# EAGLE design LEDMatrixMC (EAGLE 6.3)
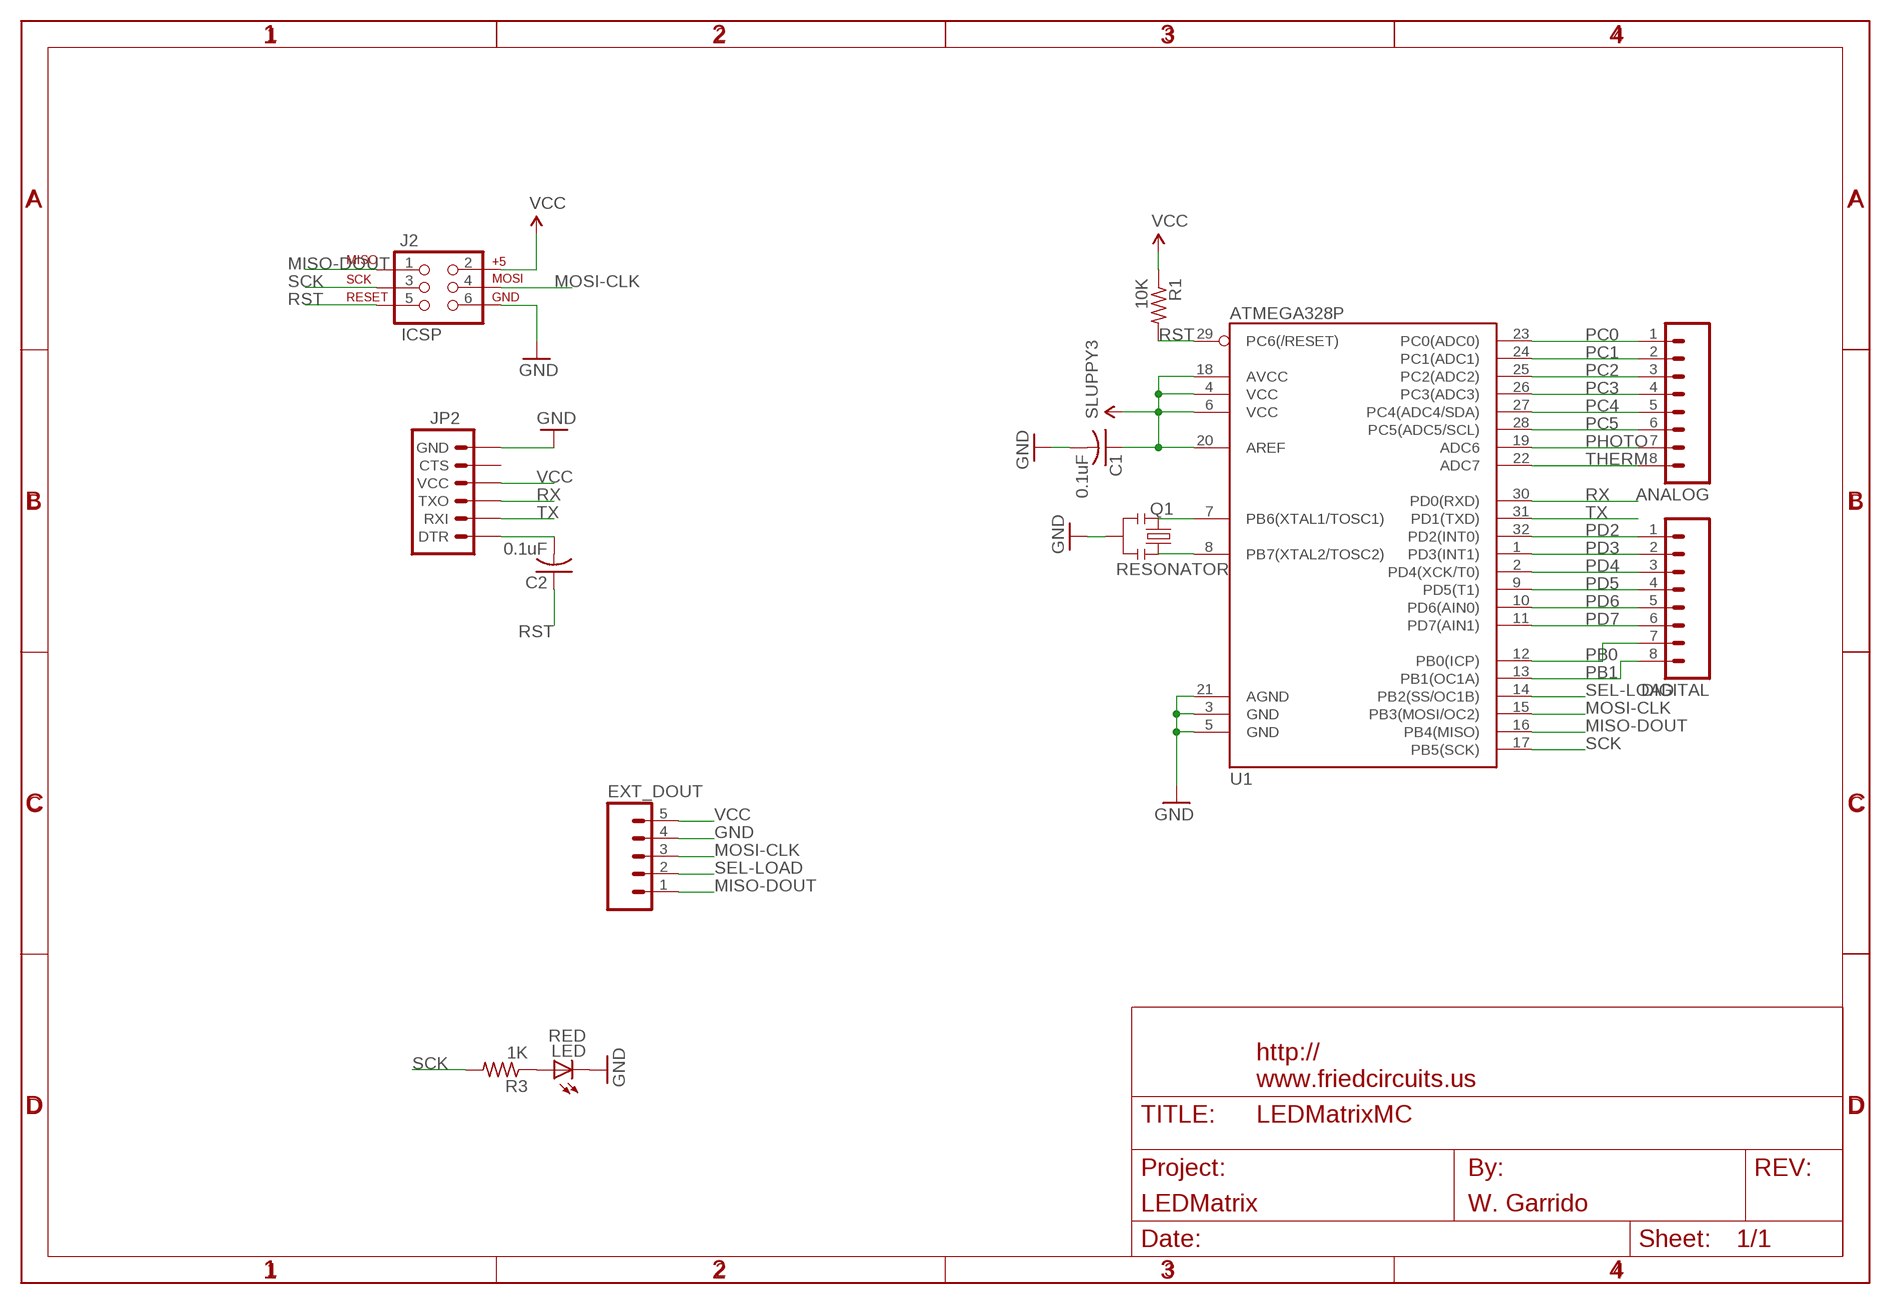
[diagram p0: schematic, sheet 1]

## Parts
ANALOG  M08LOCK  [1X08_LOCK]
C1  0.1uF  C-USC0805K  [C0805K]
C2  0.1uF  C-USC0805K  [C0805K]
DIGITAL  M08LOCK  [1X08_LOCK]
EXT_DOUT  M05LOCK_LONGPADS  [1X05_LOCK_LONGPADS]
J2  ICSP  AVR_SPI_PRG_62X3_LOCK  [2X3_LOCK]
JP2  ARDUINO_SERIAL_PROGRAMLOCK  [1X06_LOCK]
LED  RED  LEDCHIPLED_0805  [CHIPLED_0805]
Q1  RESONATOR  RESONATORSMD  [RESONATOR-SMD]
R1  10K  R-US_R0805  [R0805]
R3  1K  R-US_R0805  [R0805]
U1  ATMEGA328P  ATMEGA328_SMT  [TQFP32-08]
U$1  FRAME_DINA4_L  [FC_CREDIT]

## Nets
GND: C1.2 EXT_DOUT.4 J2.6 JP2.6(GND) LED.C Q1.2 U1.3(GND) U1.5(GND) U1.21(AGND)
MISO-DOUT: EXT_DOUT.1 J2.1 U1.16(PB4(MISO))
MOSI-CLK: EXT_DOUT.3 J2.4 U1.15(PB3(MOSI/OC2))
N$1: C2.2 JP2.1(DTR)
N$5: Q1.1 U1.8(PB7(XTAL2/TOSC2))
N$6: Q1.3 U1.7(PB6(XTAL1/TOSC1))
N$22: LED.A R3.1
PB0: DIGITAL.7 U1.12(PB0(ICP))
PB1: DIGITAL.8 U1.13(PB1(OC1A))
PC0: ANALOG.1 U1.23(PC0(ADC0))
PC1: ANALOG.2 U1.24(PC1(ADC1))
PC2: ANALOG.3 U1.25(PC2(ADC2))
PC3: ANALOG.4 U1.26(PC3(ADC3))
PC4: ANALOG.5 U1.27(PC4(ADC4/SDA))
PC5: ANALOG.6 U1.28(PC5(ADC5/SCL))
PD2: DIGITAL.1 U1.32(PD2(INT0))
PD3: DIGITAL.2 U1.1(PD3(INT1))
PD4: DIGITAL.3 U1.2(PD4(XCK/T0))
PD5: DIGITAL.4 U1.9(PD5(T1))
PD6: DIGITAL.5 U1.10(PD6(AIN0))
PD7: DIGITAL.6 U1.11(PD7(AIN1))
PHOTO: ANALOG.7 U1.19(ADC6)
RST: C2.1 J2.5 R1.2 U1.29(PC6(/RESET))
RX: JP2.3(TXO) U1.30(PD0(RXD))
SCK: J2.3 R3.2 U1.17(PB5(SCK))
SEL-LOAD: EXT_DOUT.2 U1.14(PB2(SS/OC1B))
THERM: ANALOG.8 U1.22(ADC7)
TX: JP2.2(RXI) U1.31(PD1(TXD))
VCC [power]: C1.1 EXT_DOUT.5 J2.2 JP2.4(VCC) R1.1 U1.4(VCC) U1.6(VCC) U1.18(AVCC) U1.20(AREF) ; supply symbol labelled SLUPPY3
Unconnected: JP2.5(CTS)

## Library data of the parts
ANALOG DIGITAL = SparkFun-Connectors:M08: Header 8 Standard 8-pin 0.1" header. Use with straight break away headers (SKU : PRT-00116), right angle break away headers (PRT-00553), swiss pins (PRT-00743), machine pins (PRT-00117), and female headers (PRT-00115).
C1 C2 = adafruit:C-US: CAPACITOR, American symbol
EXT_DOUT = SparkFun-Connectors:M05: Header 5 Standard 5-pin 0.1" header. Use with straight break away headers (SKU : PRT-00116), right angle break away headers (PRT-00553), swiss pins (PRT-00743), machine pins (PRT-00117), and female headers (PRT-00115). Molex polarized connector foot print use with SKU : PRT-08230 with associated crimp pins and housings.
J2 = SparkFun-Connectors:AVR_SPI_PRG_6: AVR ISP 6 Pin This is the reduced ISP connector for AVR programming. Common on Arduino. This footprint will take up less PCB space and can be used with a 10-pin to 6-pin adapter such as SKU: BOB-08508
JP2 = SparkFun-Connectors:ARDUINO_SERIAL_PROGRAM: FTDI connector footprints
LED = adafruit:LED: LED OSRAM: - CHIPLED LG R971, LG N971, LY N971, LG Q971, LY Q971, LO R971, LY R971 LH N974, LH R974 LS Q976, LO Q976, LY Q976 LO Q996 - Hyper CHIPLED LW Q18S LB Q993, LB Q99A, LB R99A - SideLED LS A670, LO A670, LY A670, LG A670, LP A670 LB A673, LV A673, LT A673, LW A673 LH A674 LY A675 LS A676, LA A676, LO A676, LY A676, LW A676 LS A679, LY A679, LG A679 - Hyper Micro SIDELED® LS Y876, LA Y876, LO Y876, LY Y876 LT Y87S - SmartLED LW L88C, LW L88S LB L89C, LB L89S, LG L890 LS L89K, LO L89K, LY L89K LS L896, LA L896, LO L896, LY L896 - TOPLED LS T670, LO T670, LY T670, LG T670, LP T670 LSG T670, LSP T670, LSY T670, LOP T670, LYG T670 LG T671, LOG T671, LSG T671 LB T673, LV T673, LT T673, LW T673 LH T674 LS T676, LA T676, LO T676, LY T676, LB T676, LH T676, LSB T676, LW T676 LB T67C, LV T67C, LT T67C, LS T67K, LO T67K, LY T67K, LW E67C LS E67B, LA E67B, LO E67B, LY E67B, LB E67C, LV E67C, LT E67C LW T67C LS T679, LY T679, LG T679 LS T770, LO T770, LY T770, LG T770, LP T770 LB T773, LV T773, LT T773, LW T773 LH T774 LS E675, LA E675, LY E675, LS T675 LS T776, LA T776, LO T776, LY T776, LB T776 LHGB T686 LT T68C, LB T68C - Hyper Mini TOPLED® LB M676 - Mini TOPLED Santana® LG M470 LS M47K, LO M47K, LY M47K Source: http://www.osram.convergy.de/
Q1 = SparkFun:RESONATOR: Resonator Small SMD resonator. This is the itty bitty 10/20MHz resonators with built in caps. CSTCE10M0G55 and CSTCE20M0V53. Footprint has been reviewed closely but hasn't been tested yet.
R1 R3 = adafruit:R-US_: RESISTOR, American symbol
U1 = SparkFun-DigitalIC:ATMEGA328_SMT: 32-Pin Atmega328 part Commonly used on Arduino compatible boards Available in QFP and QFN packages TQFP is IC-09069 QFN is non-stock; PROD_ID: IC-09069
U$1 = FriedCircuits:FRAME_DINA4_L: A4 FC frame Standard FriedCircuits schematic frame. Automagically adds the standard texts to the PCB Use the atrribute in the schematic editor to change the fields.; AUTHOR: W. Garrido; FF1: fulfillment by; FF2: FriedCircuits; FF3: www.friedcircuits.us; PROJECT: LEDMatrix; URL1: http://; URL2: www.friedcircuits.us

## Net classes
0 default: width 0.203 mm, drill 0.203 mm
1 power: width 0.254 mm, drill 0.203 mm
3 3.3V: width 0.254 mm, drill 0.203 mm

## Board
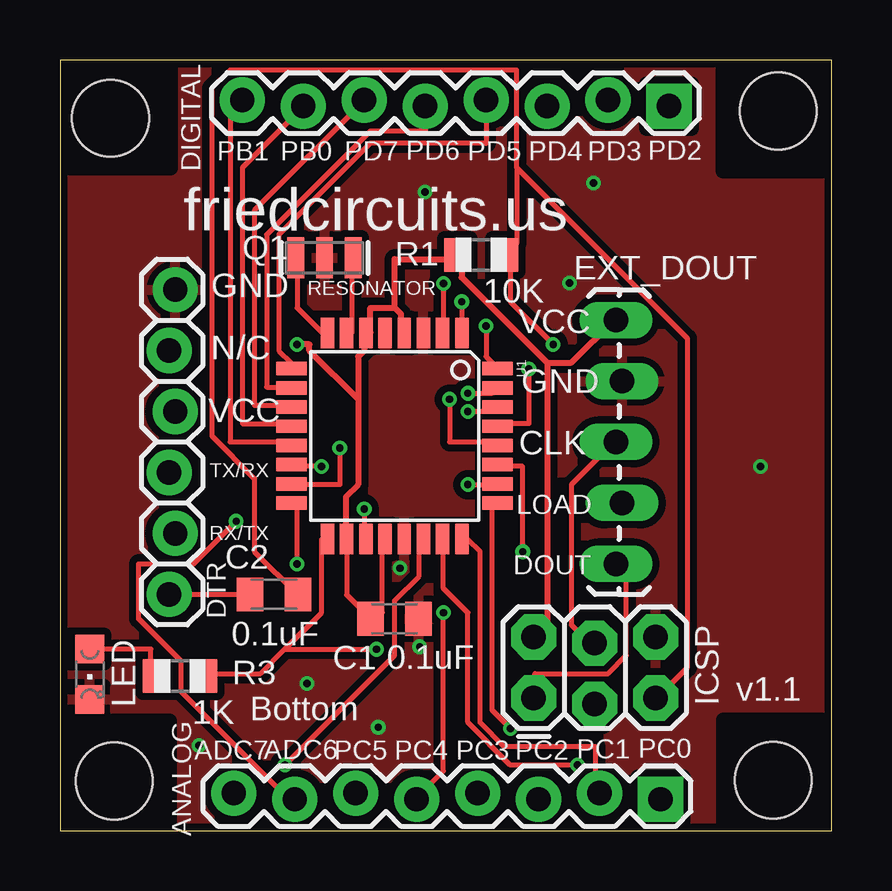
[diagram p1: board, top side]
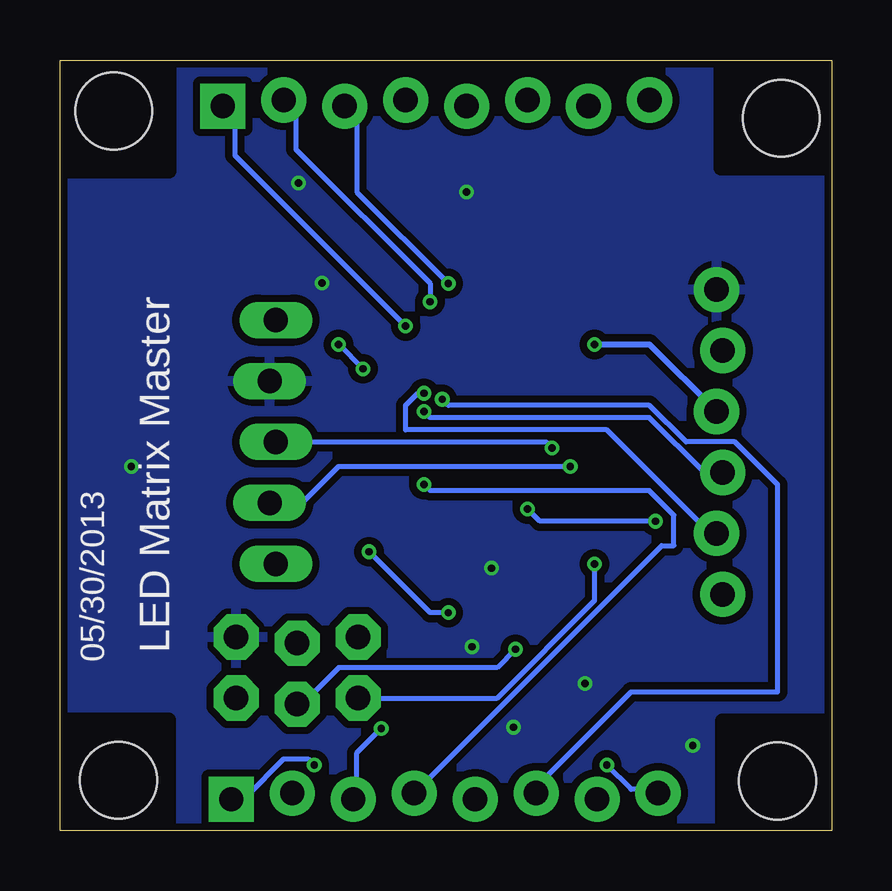
[diagram p2: board, bottom side, seen from below]

Size 32.16 x 32.12 mm. Coordinates in mm from the lower left corner, seen from the top.
Outline: 0,0 32.16,0 32.16,32.12 0,32.12 0,0
Copper layers (1*16): Top 0.035mm / dielectric 1.5mm / Bottom 0.035mm
Design rules "Fusion_eagle_rule_v1.1": minimum track width 6mil, minimum drill 12mil, track to track 6mil, track to pad 6mil, pad to pad 6mil, via to via 6mil, smd to smd 0mil, copper to edge 10mil, drill to drill 10mil, minimum pad ring 10mil, minimum via ring 6mil, stop-mask expansion 2mil, vias tented up to drill 100mil, thermal gap 10mil
Holes 3.2 mm at 29.92,30 2.26,2.08 29.72,2.11 2.11,29.69
tRestrict: area 27.6,27.5 to 32,32; area 0.2,0.1 to 4.6,4.6; area 27.6,0.2 to 32,4.6; area 0.2,27.6 to 4.6,32
bRestrict: area 27.6,27.5 to 32,32; area 0.2,0.1 to 4.6,4.6; area 27.6,0.2 to 32,4.6; area 0.2,27.6 to 4.6,32

### Footprints (pad centres in the part's own frame; a part is rotated, then mirrored left to right if it is on the bottom)
1X08_LOCK = drill 1.016 pad 1.88 square: 1 0,0.127 | drill 1.016 pad 1.88: 2 2.54,-0.127; 3 5.08,0.127; 4 7.62,-0.127; 5 10.16,0.127; 6 12.7,-0.127; 7 15.24,0.127; 8 17.78,-0.127
C0805K = smd 1.1 x 1.4: 1 -1,0; 2 1,0
1X05_LOCK_LONGPADS = drill 1.016 long: 1 0,0; 2 2.54,-0.254; 3 5.08,0; 4 7.62,-0.254; 5 10.16,0
2X3_LOCK = drill 1.016 pad 1.88 octagon: 1 0,0; 2 0,2.54; 3 2.54,-0.254; 4 2.54,2.286; 5 5.08,0; 6 5.08,2.54
1X06_LOCK = drill 1.016 pad 1.88: 1 0,0; 2 2.54,-0.254; 3 5.08,0; 4 7.62,-0.254; 5 10.16,0; 6 12.7,-0.254
CHIPLED_0805 = smd 1.2 x 1.2: A 0,-1.05; C 0,1.05
RESONATOR-SMD = smd 0.7 x 1.7: 1 -1.2,0; 2 0,0; 3 1.2,0
R0805 = smd 1.1 x 1.4: 1 -1,0; 2 1,0
TQFP32-08 = smd 1.27 x 0.559: 1 -4.293,2.8; 2 -4.293,2; 3 -4.293,1.2; 4 -4.293,0.4; 5 -4.293,-0.4; 6 -4.293,-1.2; 7 -4.293,-2; 8 -4.293,-2.8; 17 4.293,-2.8; 18 4.293,-2; 19 4.293,-1.2; 20 4.293,-0.4; 21 4.293,0.4; 22 4.293,1.2; 23 4.293,2; 24 4.293,2.8 | smd 0.559 x 1.27: 9 -2.8,-4.293; 10 -2,-4.293; 11 -1.2,-4.293; 12 -0.4,-4.293; 13 0.4,-4.293; 14 1.2,-4.293; 15 2,-4.293; 16 2.8,-4.293; 25 2.8,4.293; 26 2,4.293; 27 1.2,4.293; 28 0.4,4.293; 29 -0.4,4.293; 30 -1.2,4.293; 31 -2,4.293; 32 -2.8,4.293

### Placement (x,y rotation side)
ANALOG  25.02,1.45 180 top
C1  13.94,8.84 0 top
C2  8.92,9.86 180 top
DIGITAL  25.37,30.33 180 top
EXT_DOUT  23.16,11.13 90 top
J2  19.74,5.54 0 top
JP2  4.55,9.86 90 top
LED  1.24,6.53 180 top
Q1  11.02,23.88 0 top
R1  17.55,24 0 top
R3  5,6.45 0 top
U1  13.94,16.46 270 top
U$1  32.99,13.92 0 top

### Tracks (layer width: path | path; a pad name or v marks a point on that pad's centre or on a via)
GND  (via drill 0.3)
  other vias: 15.21,26.62 5.79,3.56 14.17,10.95 13.26,4.32 14.99,7.67 29.18,15.19 21.23,22.83 10.29,6.15 22.22,27
  pour Top (isolate 0.305): -0.03,-0.05 32.23,-0.05 32.23,32.21 -0.03,32.21
  pour Bottom (isolate 0.305): -0.03,-0.05 32.23,-0.05 32.23,0.46 32.23,32.21 -0.03,32.21 -0.03,31.95
MISO-DOUT  (via drill 0.3)
  Top 0.203: v9.88,11.13 9.88,13.41 U1.16 | EXT_DOUT.1 23.34,11.13 23.6,10.87 23.6,7.32 22.83,6.55 19.79,6.55 19.79,5.54 J2.1
  Bottom 0.203: v9.88,11.13 9.88,9.6 13.94,5.54 J2.1
MOSI-CLK  (via drill 0.3)
  Top 0.203: v11.66,15.95 11.66,14.43 9.88,14.43 U1.15 | J2.4 22.07,7.82 21.31,8.59 21.31,14.43 23.09,16.21 EXT_DOUT.3
  Bottom 0.203: v11.66,15.95 11.91,16.21 EXT_DOUT.3
N$1
  Top 0.203: JP2.1 C2.2
N$5
  Top 0.203: U1.8 10.9,20.78 9.88,21.79 9.88,23.83 Q1.1
N$6
  Top 0.203: U1.7 12.17,20.78 12.17,23.83 Q1.3
N$22
  Top 0.203: LED.A 3.78,7.57 3.78,6.55 R3.1
PB0
  Top 0.203: U1.12 9.63,16.97 7.59,16.97 7.59,27.64 10.13,30.18 DIGITAL.7
PB1
  Top 0.203: U1.13 9.63,16.21 7.09,16.21 7.09,29.92 7.59,30.43 DIGITAL.8
PC0  (via drill 0.3)
  Top 0.203: v21.56,2.74 18.77,2.74 16.99,4.52 16.99,9.09 15.98,10.11 15.98,12.14 U1.23
  Bottom 0.203: v21.56,2.74 21.82,3 22.83,3 24.36,1.47 24.87,1.47 ANALOG.1
PC1
  Top 0.203: U1.24 16.99,12.14 17.5,11.63 17.5,4.52 18.52,3.51 22.33,3.51 22.33,1.73 ANALOG.2
PC2  (via drill 0.3)
  Top 0.203: v18.77,4.27 18.01,5.03 18.01,13.41 U1.25
  Bottom 0.203: v18.77,4.27 19.79,3.25 19.79,1.47 ANALOG.3
PC3  (via drill 0.3)
  Top 0.203: v16.99,14.43 18.01,14.43 U1.26
  Bottom 0.203: v16.99,14.43 16.74,14.17 7.59,14.17 6.58,13.16 6.58,11.89 7.09,11.89 ANALOG.4
PC4  (via drill 0.3)
  Top 0.203: v19.28,11.63 19.28,15.19 18.26,15.19 U1.27 | v15.98,9.09 15.98,2.49 14.96,1.47 ANALOG.5
  Bottom 0.203: v19.28,11.63 16.74,9.09 v15.98,9.09
PC5  (via drill 0.3)
  Top 0.203: v16.23,17.98 16.23,16.21 18.01,16.21 U1.28
  Bottom 0.203: v16.23,17.98 15.98,17.73 7.59,17.73 6.07,16.21 4.04,16.21 2.26,14.43 2.26,5.79 8.36,5.79 12.42,1.73 ANALOG.6
PD2  (via drill 0.3)
  Top 0.203: v17.75,21.03 17.75,19.76 18.01,19.51 U1.32
  Bottom 0.203: v17.75,21.03 24.87,28.14 24.87,30.18 25.37,30.18 DIGITAL.1
PD3  (via drill 0.3)
  Top 0.203: v16.74,22.05 16.74,20.78 U1.1
  Bottom 0.203: v16.74,22.05 16.74,22.81 22.33,28.4 22.33,30.43 22.83,30.43 DIGITAL.2
PD4  (via drill 0.3)
  Top 0.203: v15.98,22.81 15.98,20.78 U1.2
  Bottom 0.203: v15.98,22.81 19.79,26.62 19.79,30.18 20.29,30.18 DIGITAL.3
PD5
  Top 0.203: DIGITAL.4 17.75,28.65 12.93,28.65 9.12,24.84 9.12,20.02 9.63,19.51 U1.9
PD6
  Top 0.203: DIGITAL.5 15.21,29.16 12.93,29.16 8.61,24.84 8.61,18.49 9.63,18.49 U1.10
PD7
  Top 0.203: U1.11 9.63,17.73 8.1,17.73 8.1,25.86 12.67,30.43 DIGITAL.6
PHOTO  (via drill 0.3)
  Top 0.203: v12.67,13.41 12.67,12.4 U1.19 | v7.34,12.9 5.56,11.13 3.28,11.13 3.28,8.84 5.05,7.06 5.05,5.79 9.63,1.22 ANALOG.7
  Bottom 0.203: v12.67,13.41 12.17,12.9 v7.34,12.9
RST  (via drill 0.3)
  Top 0.203: v19.53,19.25 19.53,16.97 18.26,16.97 U1.29 | v20.55,20.27 18.77,22.05 18.77,23.83 R1.2 19.02,24.48 19.02,27.64 | 19.02,27.64 19.02,31.7 7.09,31.7 6.32,30.94 6.32,16.46 8.1,14.68 8.1,11.63 9.88,9.86 C2.1 | 19.02,27.64 26.14,20.52 26.14,6.81 24.87,5.54 J2.5
  Bottom 0.203: v20.55,20.27 v19.53,19.25
RX  (via drill 0.3)
  Top 0.203: v16.99,17.48 18.01,17.48 U1.30
  Bottom 0.203: v16.99,17.48 16.74,17.22 7.59,17.22 5.31,14.94 JP2.3
SCK  (via drill 0.3)
  Top 0.203: 9.37,7.57 8.36,6.55 6.07,6.55 R3.2 | 9.37,7.57 10.9,9.09 10.9,12.14 U1.17 | 9.37,7.57 v13.18,7.57
  Bottom 0.203: v13.18,7.57 13.94,6.81 20.55,6.81 22.07,5.28 J2.3
SEL-LOAD  (via drill 0.3)
  Top 0.203: v10.9,15.19 9.88,15.19 U1.14
  Bottom 0.203: v10.9,15.19 20.55,15.19 22.07,13.67 EXT_DOUT.2
THERM  (via drill 0.3)
  Top 0.203: v9.37,2.74 13.94,7.32 13.94,9.6 14.96,10.62 14.96,12.14 U1.22
  Bottom 0.203: v9.37,2.74 8.36,1.73 7.34,1.73 ANALOG.8
TX  (via drill 0.3)
  Top 0.203: v16.99,18.24 18.01,18.24 U1.31
  Bottom 0.203: v16.99,18.24 17.25,18.24 17.75,17.73 17.75,16.71 9.37,16.71 5.05,12.4 JP2.2
VCC  (via drill 0.3)
  Top 0.203: U1.20 13.44,12.14 13.44,9.09 13.18,8.84 C1.1 11.94,9.84 U1.18
  Top 0.254: 12.42,17.98 12.42,19.76 12.67,20.02 12.67,20.52 U1.6 12.93,20.78 12.93,21.79 13.94,21.79 | 12.42,17.98 12.42,14.43 11.91,13.92 11.91,12.4 U1.18 | 13.94,21.79 14.2,21.54 14.2,20.78 U1.4 | 13.94,21.79 13.94,23.83 16.48,23.83 R1.1 16.74,23.83 16.74,23.06 20.29,19.51 | 20.29,19.51 21.31,19.51 23.09,21.29 EXT_DOUT.5 | 20.29,19.51 20.29,8.59 19.79,8.08 J2.2 | v9.88,20.27 10.39,20.27 10.39,20.02 12.42,17.98
  Bottom 0.254: JP2.4 7.59,20.27 v9.88,20.27

### Text on the board
tPlace: PB1 | PB0 | PD7 | PD6 | PD5 | PD4 | PD3 | PD2 | GND | VCC | N/C | GND | VCC | CLK | TX/RX | LOAD | RX/TX | DOUT | DTR | v1.1 | ADC7 | ADC6 | PC5 | PC4 | PC3 | PC2 | PC1 | PC0
bPlace: LED Matrix Master
tNames: friedcircuits.us | Bottom
bNames: 05/30/2013